# Altium schematic sheet Driver3.0.SchDoc: Driver
size A4; DrawnBy: Poon Mannchun; Revision: V 3.3
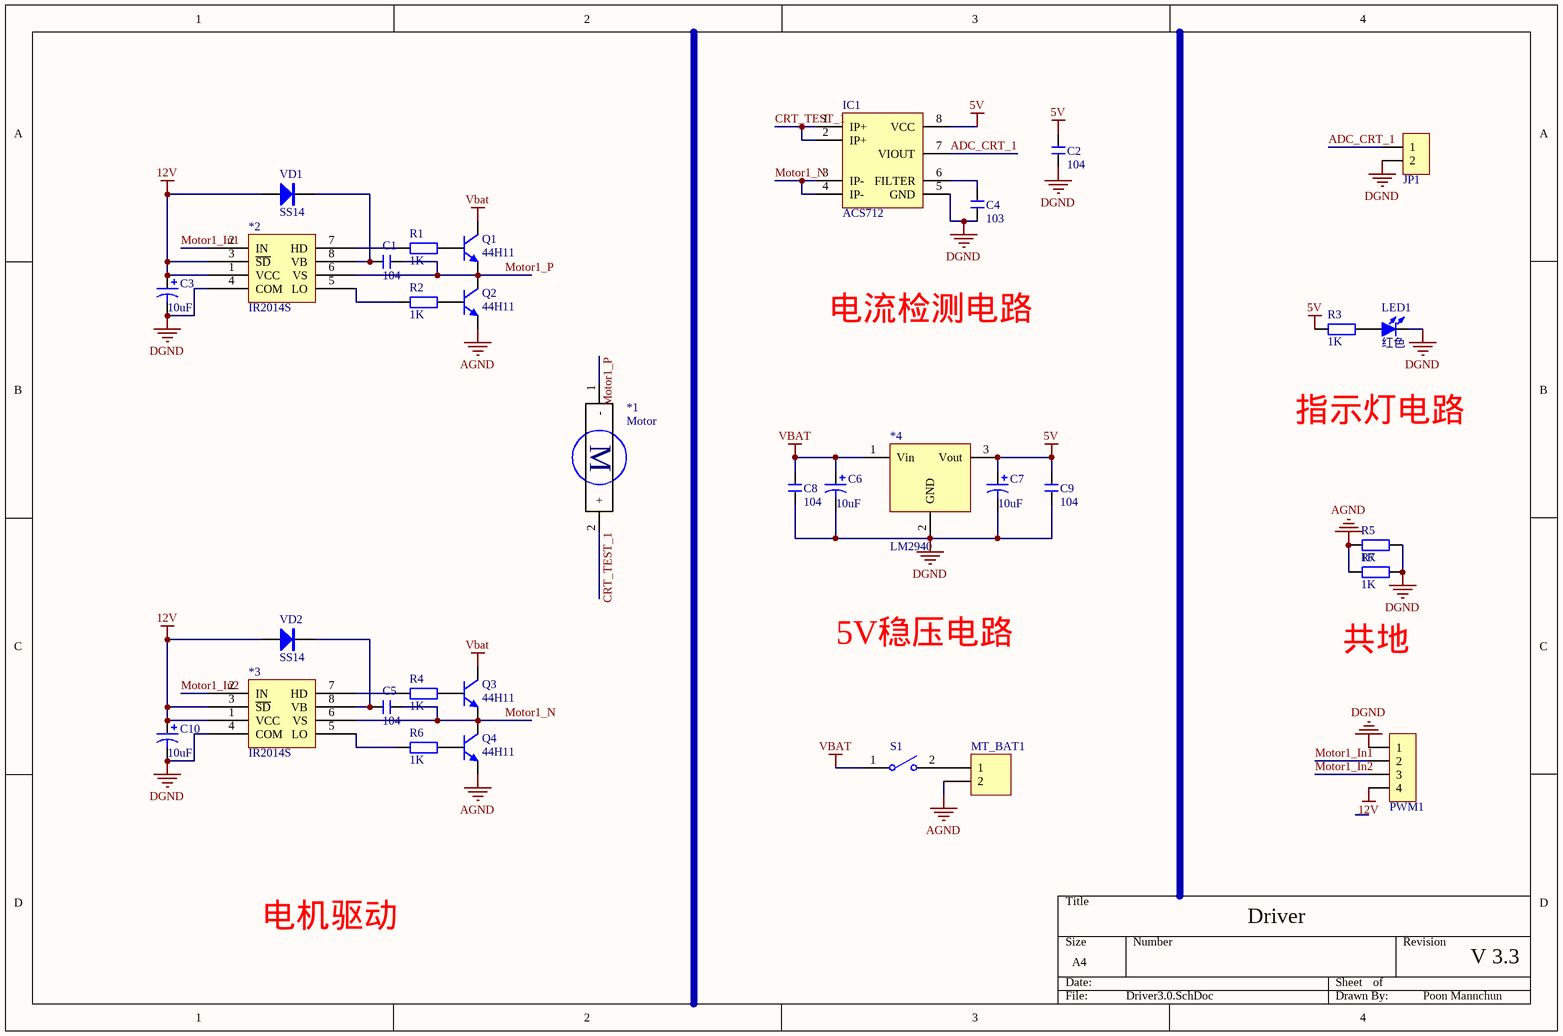
[diagram p0: Driver3.0.SchDoc]

## Parts
*1  Motor  [SW - duplicate]
*2  IR2014S  [SOP8_N]
*3  IR2014S  [SOP8_N]
*4  LM2940  [SOT223_N]
C1  104  [C 0805_L]
C2  104  [C 0805_L]
C3  value 10uF  [CD A(3216)]  (hidden comment: Cap Pol1)
C4  103  [C 0805_L]
C5  104  [C 0805_L]
C6  value 10uF  [CD A(3216)]  (hidden comment: Cap Pol1)
C7  value 10uF  [CD A(3216)]  (hidden comment: Cap Pol1)
C8  104  [C 0805_L]
C9  104  [C 0805_L]
C10  value 10uF  [CD A(3216)]  (hidden comment: Cap Pol1)
IC1  ACS712  [SOP8_L]
JP1  HDR-1X2  [HDR2.54-LI-2P]  (value not drawn)
LED1  红色  [LED 0805B]
MT_BAT1  Header 2  [SW - duplicate]  (value not drawn)
PWM1  HDR-1X4  [HDR2.54-LI-4P]  (value not drawn)
Q1  44H11  [TO252]
Q2  44H11  [TO252]
Q3  44H11  [TO252]
Q4  44H11  [TO252]
R1  1K  [R 0805_L]
R2  1K  [R 0805_L]
R3  1K  [R 0805_L]
R4  1K  [R 0805_L]
R5  1K  [R 0805_L]
R6  1K  [R 0805_L]
R7  1K  [R 0805_L]
S1  KCD1-101  [SW_P]  (value not drawn)
VD1  SS14  [SMA]
VD2  SS14  [SMA]

## Nets
5V: *4.3(Vout) C2.2 C7.1 C9.1 IC1.8(VCC) R3.2
12V: *2.1(VCC) *2.3(~{SD}) *3.1(VCC) *3.3(~{SD}) C3.1 C10.1 PWM1.4 VD1.1(A) VD2.1(A)
AGND: MT_BAT1.2 Q2.3(E) Q4.3(E) R5.2 R7.2
DGND: *2.4(COM) *3.4(COM) *4.2(GND) C2.1 C3.2 C4.1 C6.2 C7.2 C8.2 C9.2 C10.2 IC1.5(GND) JP1.2 LED1.2(K) PWM1.1 R5.1 R7.1
Vbat: *4.1(Vin) C6.1 C8.1 Q1.2(C) Q3.2(C) S1.1
ADC_CRT_1: IC1.7(VIOUT) JP1.1
CRT_TEST_1: *1.2(+) IC1.1(IP+) IC1.2(IP+)
Motor1_In1: *2.2(IN) PWM1.2
Motor1_In2: *3.2(IN) PWM1.3
Motor1_N: *3.6(VS) C5.2 IC1.3(IP-) IC1.4(IP-) Q3.3(E) Q4.2(C)
Motor1_P: *1.1(-) *2.6(VS) C1.2 Q1.3(E) Q2.2(C)
Net*2_5: *2.5(LO) R2.1
Net*2_7: *2.7(HD) R1.1
Net*2_8: *2.8(VB) C1.1 VD1.2(K)
Net*3_5: *3.5(LO) R6.1
Net*3_7: *3.7(HD) R4.1
Net*3_8: *3.8(VB) C5.1 VD2.2(K)
NetC4_2: C4.2 IC1.6(FILTER)
NetLED1_1: LED1.1(A) R3.1
NetMT_BAT1_1: MT_BAT1.1 S1.2
NetQ1_1: Q1.1(B) R1.2
NetQ2_1: Q2.1(B) R2.2
NetQ3_1: Q3.1(B) R4.2
NetQ4_1: Q4.1(B) R6.2

## Notes on the sheet
- 电流检测电路
- 指示灯电路
- 5V稳压电路
- 共地
- 电机驱动
- (in symbol Motor) M

## Library data of the parts
C1 C2 C4 C5 C8 C9 = C: 无极性贴片电容; 版权归属: 源创客; BOM名称: 无极性贴片电容; 学习资源: www.ooocke.com
C3 C6 C7 C10 = Cap Pol1: Polarized Capacitor (Radial); Published: 8-Jun-2000; LatestRevisionDate: 17-Jul-2002; LatestRevisionNote: Re-released for DXP Platform.; PackageReference: RB7.6-15; Publisher: Altium Limited; PackageDescription: Polarized Capacitor (Radial); 2 Leads
IC1 = ACS712: 电流检测芯片; 版权归属: 源创客; BOM名称: 电流检测芯片; 学习资源: www.ooocke.com
JP1 = Header 2: 2P接插件; 版权归属: 源创客; BOM名称: 2P接插件; 学习资源: www.ooocke.com
LED1 = LED-SMD: 贴片LED; 版权归属: 源创客; BOM名称: 贴片LED; 学习资源: www.ooocke.com
MT_BAT1 = Header 2: Header, 2-Pin; LatestRevisionDate: 17-Jul-2002; LatestRevisionNote: Re-released for DXP Platform.; Publisher: Altium Limited
PWM1 = Header 4: 4P接插件; 版权归属: 源创客; BOM名称: 4P接插件; 学习资源: www.ooocke.com
Q1-Q4 = 44H11: 互补功率-NPN型; 版权归属: 源创客; 属性: 80V 8A 50W; BOM名称: 互补功率-NPN型; 学习资源: www.ooocke.com
R1-R7 = R: 贴片电阻; 版权归属: 源创客; BOM名称: 贴片电阻; 学习资源: www.ooocke.com
S1 = KCD1-101: 1路单刀船型开关; 版权归属: 源创客; BOM名称: 1路单刀船型开关; 学习资源: www.ooocke.com
VD1 VD2 = SS14: 肖特基二极管; 版权归属: 源创客; 属性: 40V/1A; BOM名称: 肖特基二极管; 学习资源: www.ooocke.com